# Altium schematic sheet LED_Controller.SchDoc
size A4
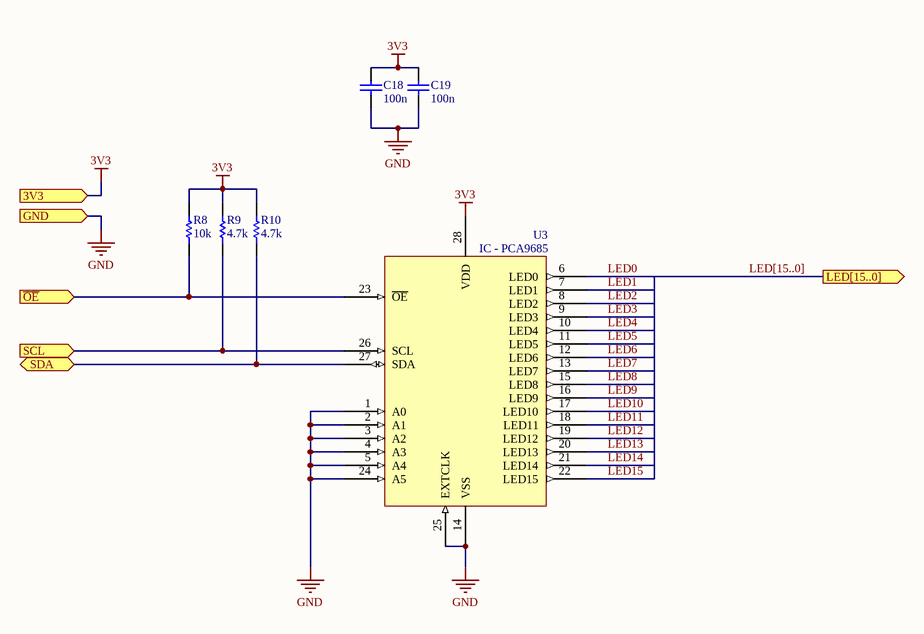
[diagram p0: LED_Controller.SchDoc]

## Parts
C18  value 100n  [CS-0603]  (hidden comment: CS - CAPACITOR)
C19  value 100n  [CS-0603]  (hidden comment: CS - CAPACITOR)
R8  value 10k  [RS-0402]  (hidden comment: RS - RESISTOR)
R9  value 4.7k  [RS-0402]  (hidden comment: RS - RESISTOR)
R10  value 4.7k  [RS-0402]  (hidden comment: RS - RESISTOR)
U3  IC - PCA9685  [IC-TSSOP-28]

## Ports
3V3, GND, LED[15..0] (out), SCL (in), SDA (bidir), ~{OE} (in)

## Nets
3V3: C18.1 C19.1 R8.2 R9.2 R10.2 U3.28(VDD) ; port 3V3
GND: C18.2 C19.2 U3.1(A0) U3.2(A1) U3.3(A2) U3.4(A3) U3.5(A4) U3.14(VSS) U3.24(A5) U3.25(EXTCLK) ; port GND
LED0: U3.6(LED0)
LED1: U3.7(LED1)
LED2: U3.8(LED2)
LED3: U3.9(LED3)
LED4: U3.10(LED4)
LED5: U3.11(LED5)
LED6: U3.12(LED6)
LED7: U3.13(LED7)
LED8: U3.15(LED8)
LED9: U3.16(LED9)
LED10: U3.17(LED10)
LED11: U3.18(LED11)
LED12: U3.19(LED12)
LED13: U3.20(LED13)
LED14: U3.21(LED14)
LED15: U3.22(LED15)
~{OE}: R8.1 U3.23(~{OE}) ; port ~{OE}
SCL: R9.1 U3.26(SCL) ; port SCL
SDA: R10.1 U3.27(SDA) ; port SDA

## Buses and harness runs
bus LED[15..0] = port LED[15..0]

## Library data of the parts
C18 C19 = CS - CAPACITOR: TOLERANCE: 10%; VOLTAGE: 16V; Supplier 1: *; Supplier Part Number 1: *; (FIELD A): *; (FLIED C): *; (FIELD B): *; Manufacturer: *
R8-R10 = RS - RESISTOR: TOLERANCE: RES TOL; POWER: RES POWER; Supplier Part Number 1: *; Supplier 1: *; (FIELD A): *; (FLIED C): *; (FIELD B): *; Manufacturer: *
U3 = IC - PCA9685: 16-channel, 12-bit PWM Fm + I2C-bus LED controller; Manufacturer: Allegro; Supplier 1: Digi-Key; Supplier Part Number 1: 568-11925-2-ND; (FLIED A): *; (FLIED B): *; (FLIED C): *